# Altium project master.PrjPcb
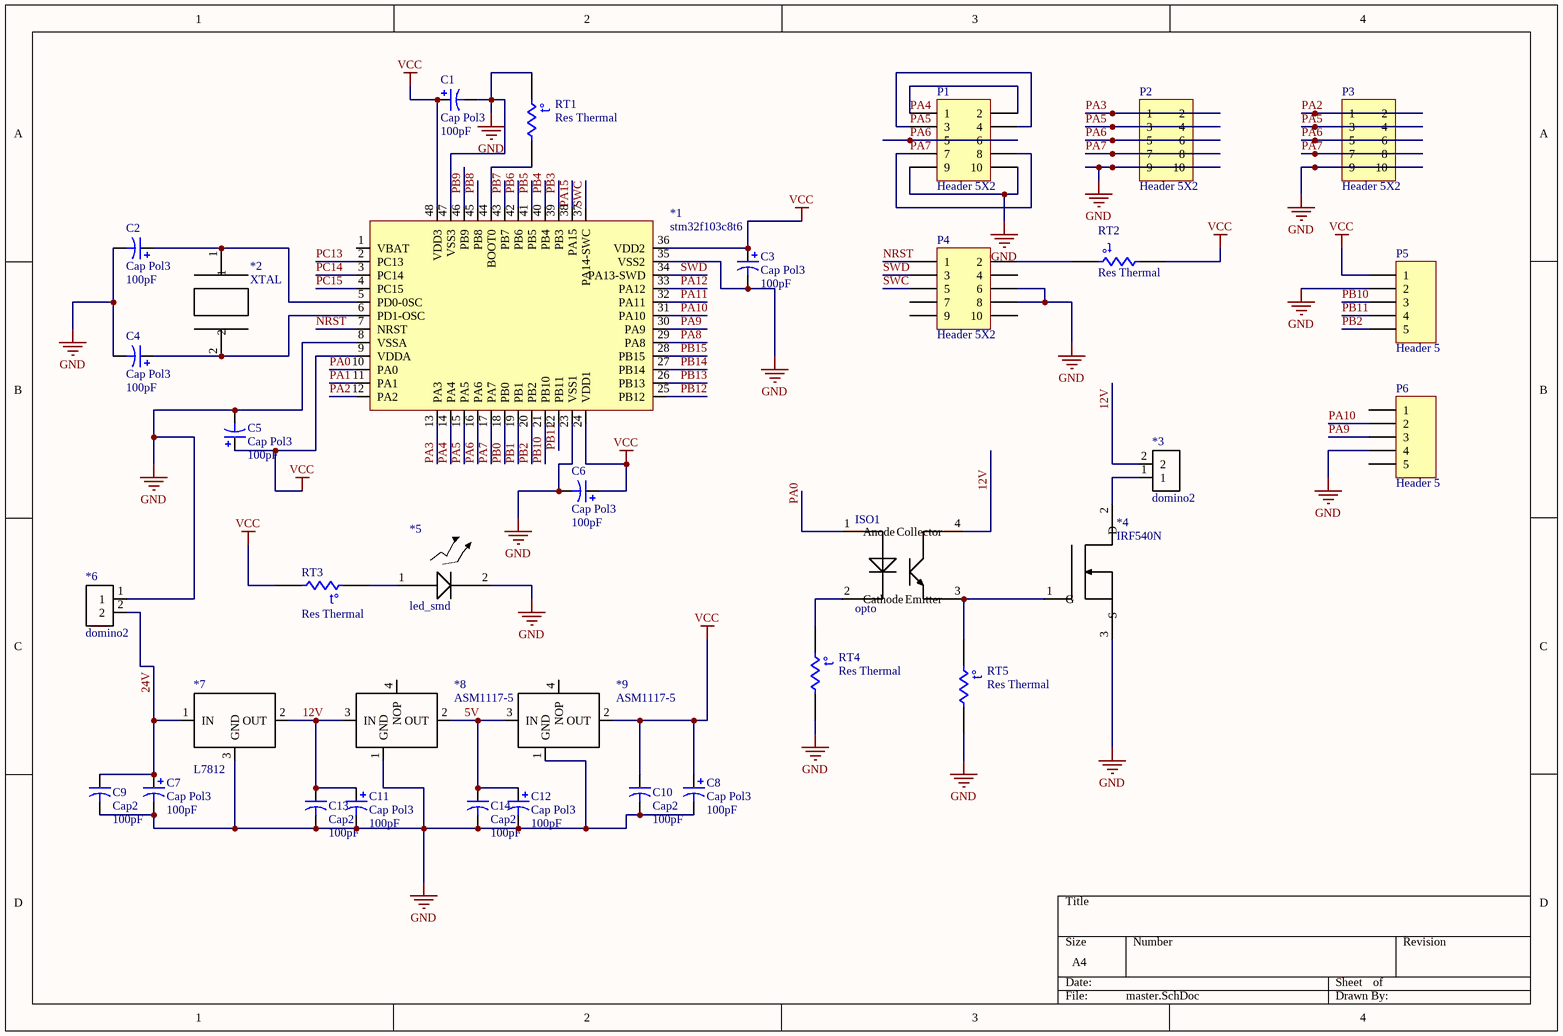
[diagram p0: master.SchDoc]
1 sheet, 35 parts. Net scope: global (net labels, ports and power ports of the same name join across sheets).
Board file: master.PcbDoc

## Sheet master.SchDoc
size A4

### Parts
*1  stm32f103c8t6  [LQFP48_stm32]
*2  XTAL  [xtal_smd]
*3  domino2  [Domino_2]
*4  IRF540N  [TO220]
*5  led_smd  [led_smd]
*6  domino2  [Domino_2]
*7  L7812  [TO220]
*8  ASM1117-5  [SOT223]
*9  ASM1117-5  [SOT223]
C1  Cap Pol3  value 100pF  [C0805]
C2  Cap Pol3  value 100pF  [C0805]
C3  Cap Pol3  value 100pF  [C0805]
C4  Cap Pol3  value 100pF  [C0805]
C5  Cap Pol3  value 100pF  [C0805]
C6  Cap Pol3  value 100pF  [C0805]
C7  Cap Pol3  value 100pF  [C0805]
C8  Cap Pol3  value 100pF  [C0805]
C9  Cap2  value 100pF  [CAPR5-4X5]
C10  Cap2  value 100pF  [CAPR5-4X5]
C11  Cap Pol3  value 100pF  [C0805]
C12  Cap Pol3  value 100pF  [C0805]
C13  Cap2  value 100pF  [CAPR5-4X5]
C14  Cap2  value 100pF  [CAPR5-4X5]
ISO1  opto  [opto_smd]
P1  Header 5X2  [HDR2X5]
P2  Header 5X2  [HDR2X5]
P3  Header 5X2  [HDR2X5]
P4  Header 5X2  [HDR2X5]
P5  Header 5  [HDR1X5]
P6  Header 5  [HDR1X5]
RT1  Res Thermal  [6-0805_N]
RT2  Res Thermal  [6-0805_N]
RT3  Res Thermal  [6-0805_N]
RT4  Res Thermal  [6-0805_N]
RT5  Res Thermal  [6-0805_N]

### Nets
GND: *1.8(VSSA) *1.23(VSS1) *1.35(VSS2) *1.47(VSS3) *4.3(S) *5.2 *6.1 *7.3(GND) *8.1(GND) *9.1(GND) C1.2 C2.2 C3.2 C4.2 C5.2 C6.2 C7.2 C8.2 C9.2 C10.2 C11.2 C12.2 C13.2 C14.2 P1.9 P1.10 P2.9 P2.10 P3.9 P3.10 P4.6 P4.8 P5.2 P6.4 RT1.1 RT4.2 RT5.2
VCC: *1.9(VDDA) *1.24(VDD1) *1.36(VDD2) *1.48(VDD3) *9.2(OUT) C1.1 C3.1 C5.1 C6.1 C8.1 C10.1 P5.1 RT2.2 RT3.2
5V: *8.2(OUT) *9.3(IN) C12.1 C14.1
12V: *3.2 *7.2(OUT) *8.3(IN) C11.1 C13.1 ISO1.4(Collector)
24V: *6.2 *7.1(IN) C7.1 C9.1
NRST: *1.7(NRST) P4.1
PA0: *1.10(PA0) ISO1.1(Anode)
PA1: *1.11(PA1)
PA2: *1.12(PA2) P3.1 P3.2
PA3: *1.13(PA3) P2.1 P2.2
PA4: *1.14(PA4) P1.1 P1.2
PA5: *1.15(PA5) P1.3 P1.4 P2.3 P2.4 P3.3 P3.4
PA6: *1.16(PA6) P1.5 P1.6 P2.5 P2.6 P3.5 P3.6
PA7: *1.17(PA7) P1.7 P1.8 P2.7 P2.8 P3.7 P3.8
PA8: *1.29(PA8)
PA9: *1.30(PA9) P6.3
PA10: *1.31(PA10) P6.2
PA11: *1.32(PA11)
PA12: *1.33(PA12)
PA15: *1.38(PA15)
PB0: *1.18(PB0)
PB1: *1.19(PB1)
PB2: *1.20(PB2) P5.5
PB3: *1.39(PB3)
PB4: *1.40(PB4)
PB5: *1.41(PB5)
PB6: *1.42(PB6)
PB7: *1.43(PB7)
PB8: *1.45(PB8)
PB9: *1.46(PB9)
PB10: *1.21(PB10) P5.3
PB11: *1.22(PB11) P5.4
PB12: *1.25(PB12)
PB13: *1.26(PB13)
PB14: *1.27(PB14)
PB15: *1.28(PB15)
PC13: *1.2(PC13)
PC14: *1.3(PC14)
PC15: *1.4(PC15)
SWC: *1.37(PA14-SWC) P4.5
SWD: *1.34(PA13-SWD) P4.3
Net*1_5: *1.5(PD0-0SC) *2.1 C2.1
Net*1_6: *1.6(PD1-OSC) *2.2 C4.1
Net*1_44: *1.44(BOOT0) RT1.2
Net*3_1: *3.1 *4.2(D)
Net*4_1: *4.1(G) ISO1.3(Emitter) RT5.1
Net*5_1: *5.1 RT3.1
NetISO1_2: ISO1.2(Cathode) RT4.1
NetP4_2: P4.2 RT2.1

Not connected (* = marked no-connect by the designer): *1 1(VBAT); *8 4(NOP); *9 4(NOP); P4 4 7 9 10; P6 1 5

### Notes on the sheet
- (in symbol Res Thermal) t°

### Library data of the parts
C1-C8 C11 C12 = Cap Pol3: Polarized Capacitor (Surface Mount); Published: 8-Jun-2000; LatestRevisionDate: 29-May-2009; LatestRevisionNote: IPC-7351 Footprint Added.; PackageReference: C0805; Publisher: Altium Limited; PackageDescription: Chip Capacitor
C9 C10 C13 C14 = Cap2: Capacitor; Published: 23-Sep-2002; PackageReference: CAPR5-4X5; Publisher: Altium Limited; PackageDescription: Capacitor; 2 Leads
P1-P4 = Header 5X2: Header, 5-Pin, Dual row; LatestRevisionDate: 17-Jul-2002; LatestRevisionNote: Re-released for DXP Platform.; Publisher: Altium Limited
P5 P6 = Header 5: Header, 5-Pin; LatestRevisionDate: 17-Jul-2002; LatestRevisionNote: Re-released for DXP Platform.; Publisher: Altium Limited
RT1-RT5 = Res Thermal: Thermistor; Published: 24-Mar-1999; LatestRevisionDate: 29-May-2009; LatestRevisionNote: IPC-7351 Footprint Added.; PackageVersion: Mar-2003; PackageReference: 6-0805; Publisher: Altium Limited; PackageDescription: Chip Resistor 0805 Case Size; Code_IPC: RESC2012